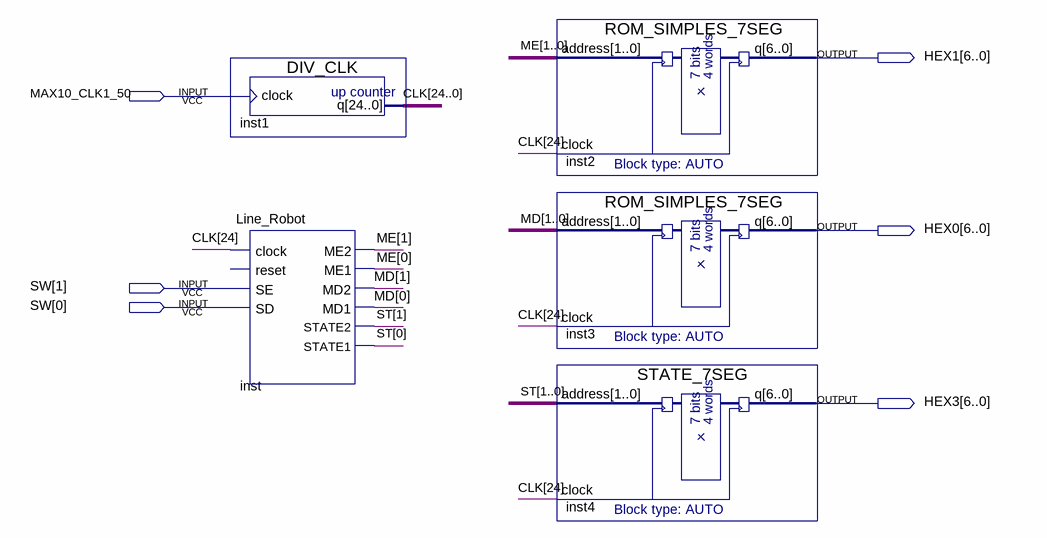
[diagram p0: schematic sheet]
// Quartus schematic Block1.bdf as structural Verilog: 5 symbols, 6 pins
module Block1 (
  input  MAX10_CLK1_50,
  input  [1:0] SW,
  output [6:0] HEX1,
  output [6:0] HEX0,
  output [6:0] HEX3
);

  wire [1:0] MD, ME, ST;
  wire [24:0] CLK;

  DIV_CLK inst1 (.clock(MAX10_CLK1_50), .q(CLK));
  Line_Robot inst (
    .clock(CLK[24]), .SE(SW[1]), .SD(SW[0]), .ME2(ME[1]), .ME1(ME[0]), .MD2(MD[1]), .MD1(MD[0]),
    .STATE2(ST[1]), .STATE1(ST[0]));  // open: reset
  ROM_SIMPLES_7SEG inst2 (.address(ME), .clock(CLK[24]), .q(HEX1));
  ROM_SIMPLES_7SEG inst3 (.address(MD), .clock(CLK[24]), .q(HEX0));
  STATE_7SEG inst4 (.address(ST), .clock(CLK[24]), .q(HEX3));
endmodule
